# Altium schematic sheet HDMI-IN.SchDoc: HDMI PORT-IN
size 193 x 292 mm; SheetNumber: 3; SheetTotal: 5; DOC_NO_SCH_DWG: #012022051402
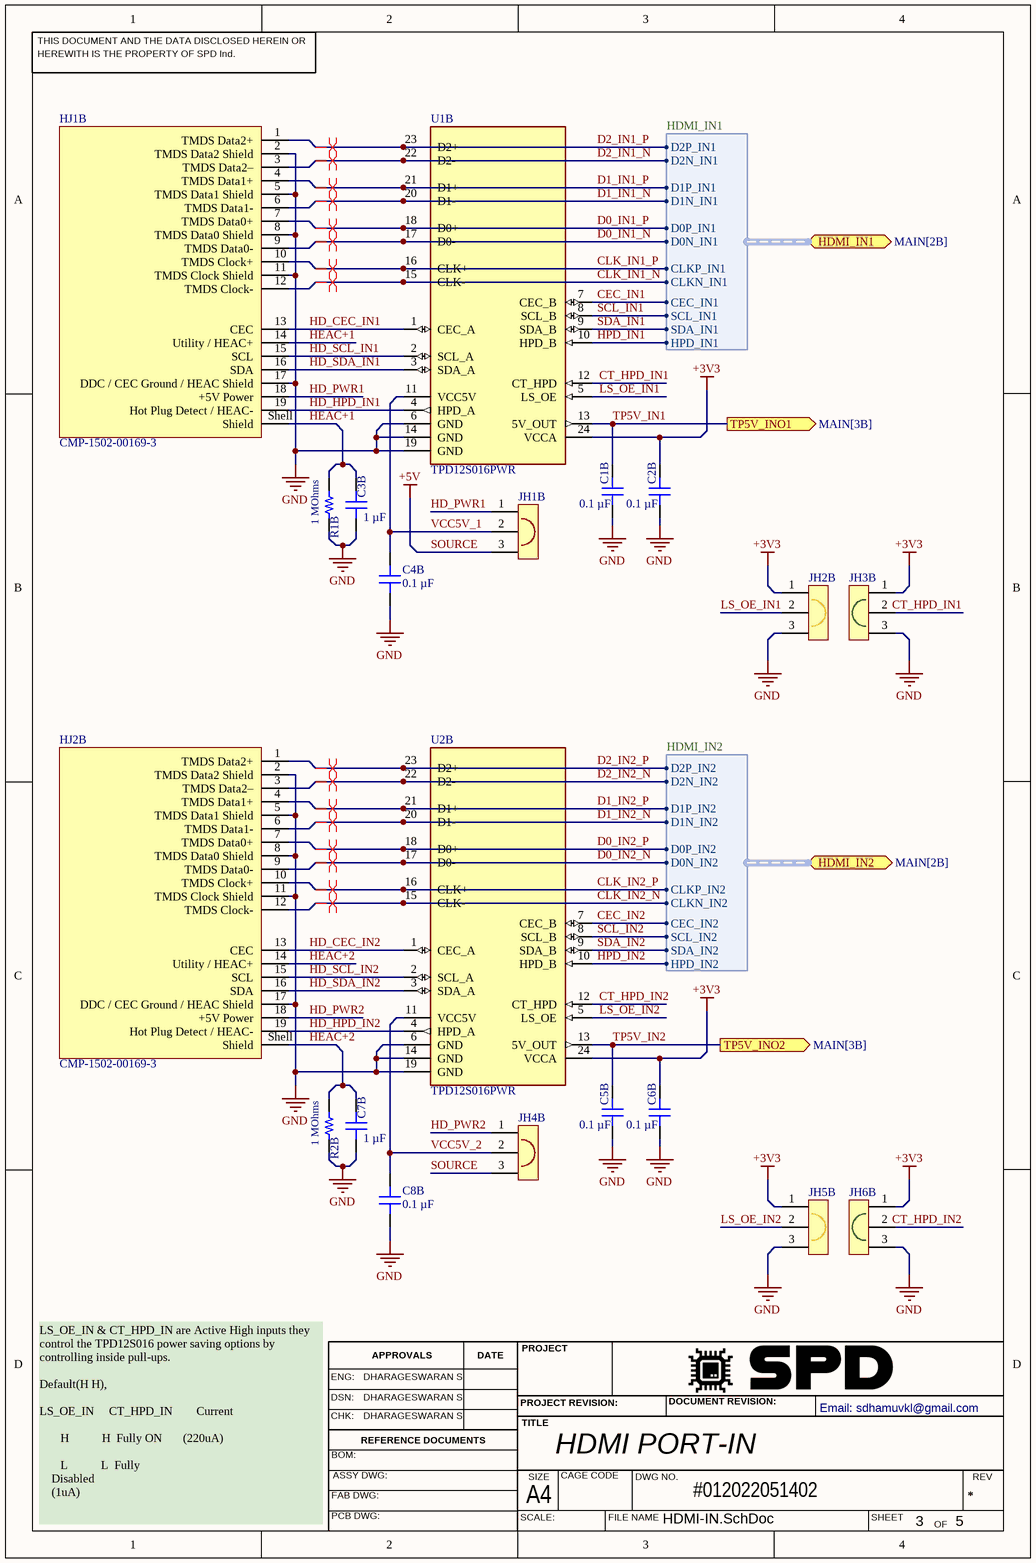
[diagram p0: HDMI-IN.SchDoc]

## Parts
C1B  0.1 µF  [CAP 0603_1608]
C2B  0.1 µF  [CAP 0603_1608]
C3B  1 µF  [CAP 0603_1608]
C4B  0.1 µF  [CAP 0603_1608]
C5B  0.1 µF  [CAP 0603_1608]
C6B  0.1 µF  [CAP 0603_1608]
C7B  1 µF  [CAP 0603_1608]
C8B  0.1 µF  [CAP 0603_1608]
HJ1B  CMP-1502-00169-3  [HDMI]
HJ2B  CMP-1502-00169-3  [HDMI]
JH1B  3PIN-JUMPER-RED  [JUMPER-3PIN-RED]  (value not drawn)
JH2B  3PIN-JUMPER-YELLOW  [JUMPER-3PIN-YELLOW]  (value not drawn)
JH3B  3PIN-JUMPER-GREEN  [JUMPER-3PIN-GREEN]  (value not drawn)
JH4B  3PIN-JUMPER-RED  [JUMPER-3PIN-RED]  (value not drawn)
JH5B  3PIN-JUMPER-YELLOW  [JUMPER-3PIN-YELLOW]  (value not drawn)
JH6B  3PIN-JUMPER-GREEN  [JUMPER-3PIN-GREEN]  (value not drawn)
R1B  1 MOhms  [RES 0603_1608]
R2B  1 MOhms  [RES 0603_1608]
U1B  TPD12S016PWR  [PW0024A_N]
U2B  TPD12S016PWR  [PW0024A_N]

## Ports
HDMI_IN1 (bidir, harness HDMI_IN1, see MAIN[2B]), HDMI_IN2 (bidir, harness HDMI_IN2, see MAIN[2B]), TP5V_INO1 (out, see MAIN[3B]), TP5V_INO2 (out, see MAIN[3B])

## Harnesses
HDMI_IN1: D2P_IN1, D2N_IN1, D1P_IN1, D1N_IN1, D0P_IN1, D0N_IN1, CLKP_IN1, CLKN_IN1, CEC_IN1, SCL_IN1, SDA_IN1, HPD_IN1
HDMI_IN2: D2P_IN2, D2N_IN2, D1P_IN2, D1N_IN2, D0P_IN2, D0N_IN2, CLKP_IN2, CLKN_IN2, CEC_IN2, SCL_IN2, SDA_IN2, HPD_IN2

## Nets
+3V3: C2B.2 C6B.2 JH2B.1 JH3B.1 JH5B.1 JH6B.1 U1B.24(VCCA) U2B.24(VCCA)
GND: C1B.1 C2B.1 C3B.1 C4B.1 C5B.1 C6B.1 C7B.1 C8B.1 HJ1B.2(TMDS_Data2_Shield) HJ1B.5(TMDS_Data1_Shield) HJ1B.8(TMDS_Data0_Shield) HJ1B.11(TMDS_Clock_Shield) HJ1B.17(DDC_/_CEC_Ground_/_HEAC_Shield) HJ2B.2(TMDS_Data2_Shield) HJ2B.5(TMDS_Data1_Shield) HJ2B.8(TMDS_Data0_Shield) HJ2B.11(TMDS_Clock_Shield) HJ2B.17(DDC_/_CEC_Ground_/_HEAC_Shield) JH2B.3 JH3B.3 JH5B.3 JH6B.3 R1B.1 R2B.1 U1B.6(GND) U1B.14(GND) U1B.19(GND) U2B.6(GND) U2B.14(GND) U2B.19(GND)
SOURCE: JH1B.3 JH4B.3  [also labelled +5V]
CEC_IN1: U1B.7(CEC_B) ; port HDMI_IN1.CEC_IN1
CEC_IN2: U2B.7(CEC_B) ; port HDMI_IN2.CEC_IN2
CLK_IN1_N: HJ1B.12(TMDS_Clock-) U1B.15(CLK-) ; port HDMI_IN1.CLKN_IN1
CLK_IN1_P: HJ1B.10(TMDS_Clock+) U1B.16(CLK+) ; port HDMI_IN1.CLKP_IN1
CLK_IN2_N: HJ2B.12(TMDS_Clock-) U2B.15(CLK-) ; port HDMI_IN2.CLKN_IN2
CLK_IN2_P: HJ2B.10(TMDS_Clock+) U2B.16(CLK+) ; port HDMI_IN2.CLKP_IN2
CT_HPD_IN1: JH3B.2 U1B.12(CT_HPD)
CT_HPD_IN2: JH6B.2 U2B.12(CT_HPD)
D0_IN1_N: HJ1B.9(TMDS_Data0-) U1B.17(D0-) ; port HDMI_IN1.D0N_IN1
D0_IN1_P: HJ1B.7(TMDS_Data0+) U1B.18(D0+) ; port HDMI_IN1.D0P_IN1
D0_IN2_N: HJ2B.9(TMDS_Data0-) U2B.17(D0-) ; port HDMI_IN2.D0N_IN2
D0_IN2_P: HJ2B.7(TMDS_Data0+) U2B.18(D0+) ; port HDMI_IN2.D0P_IN2
D1_IN1_N: HJ1B.6(TMDS_Data1-) U1B.20(D1-) ; port HDMI_IN1.D1N_IN1
D1_IN1_P: HJ1B.4(TMDS_Data1+) U1B.21(D1+) ; port HDMI_IN1.D1P_IN1
D1_IN2_N: HJ2B.6(TMDS_Data1-) U2B.20(D1-) ; port HDMI_IN2.D1N_IN2
D1_IN2_P: HJ2B.4(TMDS_Data1+) U2B.21(D1+) ; port HDMI_IN2.D1P_IN2
D2_IN1_N: HJ1B.3(TMDS_Data2–) U1B.22(D2-) ; port HDMI_IN1.D2N_IN1
D2_IN1_P: HJ1B.1(TMDS_Data2+) U1B.23(D2+) ; port HDMI_IN1.D2P_IN1
D2_IN2_N: HJ2B.3(TMDS_Data2–) U2B.22(D2-) ; port HDMI_IN2.D2N_IN2
D2_IN2_P: HJ2B.1(TMDS_Data2+) U2B.23(D2+) ; port HDMI_IN2.D2P_IN2
HD_CEC_IN1: HJ1B.13(CEC) U1B.1(CEC_A)
HD_CEC_IN2: HJ2B.13(CEC) U2B.1(CEC_A)
HD_HPD_IN1: HJ1B.19(Hot_Plug_Detect_/_HEAC-) U1B.4(HPD_A)
HD_HPD_IN2: HJ2B.19(Hot_Plug_Detect_/_HEAC-) U2B.4(HPD_A)
HD_PWR1: HJ1B.18(+5V_Power) JH1B.1
HD_PWR2: HJ2B.18(+5V_Power) JH4B.1
HD_SCL_IN1: HJ1B.15(SCL) U1B.2(SCL_A)
HD_SCL_IN2: HJ2B.15(SCL) U2B.2(SCL_A)
HD_SDA_IN1: HJ1B.16(SDA) U1B.3(SDA_A)
HD_SDA_IN2: HJ2B.16(SDA) U2B.3(SDA_A)
HEAC+1: C3B.2 HJ1B.14(Utility_/_HEAC+) HJ1B.Shell(Shield) R1B.2
HEAC+2: C7B.2 HJ2B.14(Utility_/_HEAC+) HJ2B.Shell(Shield) R2B.2
HPD_IN1: U1B.10(HPD_B) ; port HDMI_IN1.HPD_IN1
HPD_IN2: U2B.10(HPD_B) ; port HDMI_IN2.HPD_IN2
LS_OE_IN1: JH2B.2 U1B.5(LS_OE)
LS_OE_IN2: JH5B.2 U2B.5(LS_OE)
SCL_IN1: U1B.8(SCL_B) ; port HDMI_IN1.SCL_IN1
SCL_IN2: U2B.8(SCL_B) ; port HDMI_IN2.SCL_IN2
SDA_IN1: U1B.9(SDA_B) ; port HDMI_IN1.SDA_IN1
SDA_IN2: U2B.9(SDA_B) ; port HDMI_IN2.SDA_IN2
TP5V_IN1: C1B.2 U1B.13(5V_OUT) ; port TP5V_INO1
TP5V_IN2: C5B.2 U2B.13(5V_OUT) ; port TP5V_INO2
VCC5V_1: C4B.2 JH1B.2 U1B.11(VCC5V)
VCC5V_2: C8B.2 JH4B.2 U2B.11(VCC5V)

## Layout directives
differential pair: CLK_IN1_N, CLK_IN1_P, CLK_IN2_N, CLK_IN2_P, D0_IN1_N, D0_IN1_P, D0_IN2_N, D0_IN2_P, D1_IN1_N, D1_IN1_P, D1_IN2_N, D1_IN2_P, D2_IN1_N, D2_IN1_P, D2_IN2_N, D2_IN2_P

## Notes on the sheet
- LS_OE_IN & CT_HPD_IN are Active High inputs they control the TPD12S016 power saving options by controlling inside pull-ups.
  Default(H H),
  LS_OE_IN	    CT_HPD_IN        Current
  H		         H		Fully ON 						(220uA)
  L		         L		Fully
  Disabled
  (1uA)
- THIS DOCUMENT AND THE DATA DISCLOSED HEREIN OR
- HEREWITH IS THE PROPERTY OF SPD Ind.
- ENG:
- DHARAGESWARAN S
- APPROVALS
- DATE
- PROJECT
- DSN:
- CHK:
- REFERENCE DOCUMENTS
- PROJECT REVISION:
- TITLE
- DOCUMENT REVISION:
- Email: sdhamuvkl@gmail.com <https://github.com/DhamuVkl>
- BOM:
- FAB DWG:
- PCB DWG:
- ASSY DWG:
- SCALE:
- A4
- SIZE
- CAGE CODE
- FILE NAME
- DWG NO.
- SHEET
- REV
- OF

## Library data of the parts
C1B C2B C4B C5B C6B C8B = CC0603KRX7R6BB104: CAP CER 0.1UF 10V X7R 0603; Manufacturer: Yageo; id: 1361; Tolerance: ±10%; Part Number: CC0603KRX7R6BB104; Value: 0.1 µF; Temperature Coefficient: X7R; Supplier Part Number 1: 311-4055-1-ND; ComponentLink2Description: DigiKey Link; ComponentLink1URL: https://www.yageo.com/upload/media/product/productsearch/datasheet/mlcc/UPY-GPHC_X7R_6.3V-to-50V_18.pdf; PartId: 7937; Supplier 1: DigiKey; Series: CC; LastUpdated: 2023-01-03T20:07:31.763; Part Status: Active; Capacitance: 0.1 µF; Device Package: 0603 (1608 Metric); Thickness (Max): 0.035" (0.90mm); Voltage - Rated: 10V; Minimum Order: 1; Packaging: TapeAndReel; Applications: General Purpose; Package / Case: 0603 (1608 Metric); ComponentLink1Description: Datasheet; Price: 0.01; ComponentLink2URL: https://www.digikey.com/en/products/detail/yageo/CC0603KRX7R6BB104/5883741; Lifecycle Status: Active; Operating Temperature: -55°C ~ 125°C; Size / Dimension: 0.063" L x 0.031" W (1.60mm x 0.80mm); Mounting Type: Surface Mount, MLCC
C3B C7B = CC0603ZRY5V6BB105: CAP CER 1UF 10V Y5V 0603; Manufacturer: Yageo; id: 740; Temperature Coefficient: Y5V (F); Tolerance: -20%, +80%; Part Number: CC0603ZRY5V6BB105; Value: 1 µF; Supplier Part Number 1: 311-1357-1-ND; ComponentLink2Description: DigiKey Link; ComponentLink1URL: http://www.yageo.com/documents/recent/UPY-GPHC_Y5V_6.3V-to-50V_8.pdf; PartId: 5197; Supplier 1: DigiKey; Series: CC; LastUpdated: 2023-01-03T20:07:40.253; Part Status: Active; Capacitance: 1 µF; Device Package: 0603 (1608 Metric); Thickness (Max): 0.035" (0.90mm); Voltage - Rated: 10V; Minimum Order: 1; Packaging: TapeAndReel; Applications: General Purpose; Package / Case: 0603 (1608 Metric); ComponentLink1Description: Datasheet; Price: 0.01; ComponentLink2URL: https://www.digikey.com/en/products/detail/yageo/CC0603ZRY5V6BB105/2103095; Lifecycle Status: Active; Operating Temperature: -30°C ~ 85°C; Size / Dimension: 0.063" L x 0.031" W (1.60mm x 0.80mm); Mounting Type: Surface Mount, MLCC
R1B R2B = ERJ-U03J105V: RES 1 M OHM 5% 1/10W 0603 SMD; Manufacturer: Panasonic Electronic Components; id: 14889; Temperature Coefficient: -400/ +150ppm/°C; Power (Watts): 0.1W, 1/10W; Part Number: ERJ-U03J105V; Height - Seated (Max): 0.022" (0.55mm); Supplier Part Number 1: 10-ERJ-U03J105VCT-ND; Supplier Device Package: 0603; ComponentLink1Description: Datasheet; ComponentLink2URL: https://www.digikey.com/en/products/detail/panasonic-electronic-components/ERJ-U03J105V/11636001; Features: Anti-Sulfur, Automotive AEC-Q200; ComponentLink1URL: https://industrial.panasonic.com/cdbs/www-data/pdf/RDP0000/AOA0000C334.pdf; Composition: Thick Film; Tolerance: ±5%; Supplier 1: DigiKey; Series: ERJ-U03; Part Status: Active; ComponentLink2Description: DigiKey Link; Device Package: 0603 (1608 Metric); Packaging: TapeAndReel; Ratings: AEC-Q200; Minimum Order: 1; Package / Case: 0603 (1608 Metric); PartId: 63423; Lifecycle Status: Active; LastUpdated: 2023-01-02T20:28:16.920; Operating Temperature: -55°C ~ 155°C; Number Of Terminations: 2; Value: 1 MOhms; Size / Dimension: 0.063" L x 0.031" W (1.60mm x 0.80mm); Price: 0.01; Resistance: 1 MOhms
U1B U2B = CMP-0326-00070-3: Value-Line HDMI Companion Chip for Portable Applications, 12 Channels, -40 to +85 degC, 24-pin TSSOP (PW), Green (RoHS & no Sb/Br); Manufacturer: Texas Instruments; Differential Capacitance(pF): 0.05; IEC 61000-4-2 Contact(+/- kV): 8; SubFamily: ESD Solution; Breakdown Voltage(Min)(V): 9; IO Capacitance(Typ)(pF): 1; IO Leakage Current(nA): 1000; ComponentLink3Description: URL Link1; PackageReference: PW0024A; PackageDescription: 24-Pin Thin Small Outline Package 0.65 mm Pitch; PartNumber: TPD12S016PWR; ComponentLink3URL: SamplesURL:http://www.ti.com/product/tpd12s016#samples; ComponentLink2Description: Datasheet; ComponentLink2URL: http://www.ti.com/general/docs/lit/getliterature.tsp?genericPartNumber=TPD12S016&fileType=pdf; ComponentLink1Description: Manufacturer URL; ComponentLink1URL: http://www.ti.com/; Eco-Plan: Green (RoHS & no Sb/Br); Mounting Technology: Surface Mount; DatasheetVersion: SLLSE96A; PackageVersion: revG, Feb-2011
HJ1B HJ2B = CMP-1502-00169-3: Supplier 1: Mouser; Supplier Part Number 1: 538-208658-1051; Supplier 2: Mouser; Supplier Part Number 2: 710-685119134923